# Altium project RF-UNIT-SPLIT.PrjPcb
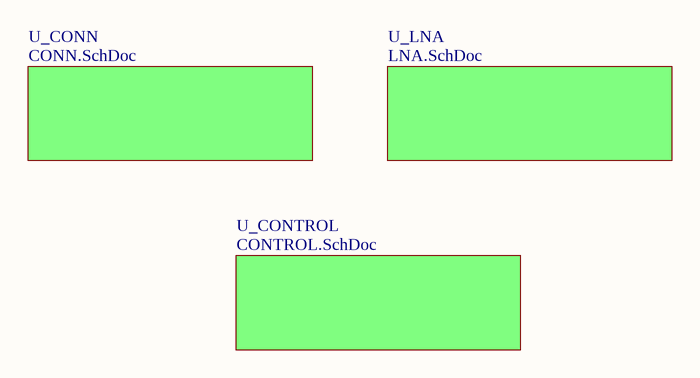
[diagram p0: RF-UNIT-SPLIT.SCHDOC]
4 sheets, 85 parts. Net scope: global (net labels, ports and power ports of the same name join across sheets).
Board file: RF-UNIT-SPLIT.PcbDoc
Sheets:
  RF-UNIT-SPLIT.SCHDOC
    U_CONN = CONN.SchDoc
    U_CONTROL = CONTROL.SchDoc
    U_LNA = LNA.SchDoc

## Sheet RF-UNIT-SPLIT.SCHDOC: RF-UNIT BIG
size A4; DocumentNumber: 12; Revision: 2.0; SheetNumber: 12; SheetTotal: 18

### Sub-sheets
U_CONN = CONN.SchDoc: no entries
U_CONTROL = CONTROL.SchDoc: no entries
U_LNA = LNA.SchDoc: no entries

### Notes on the sheet
- Title
- Size:
- Date:
- A4
- Number:
- Time:
- Revision:
- Sheet
- of
- File:

## Sheet CONN.SchDoc: CONNECTIONS
size A4; DocumentNumber: 14; Revision: 2.0; SheetNumber: 14; SheetTotal: 18
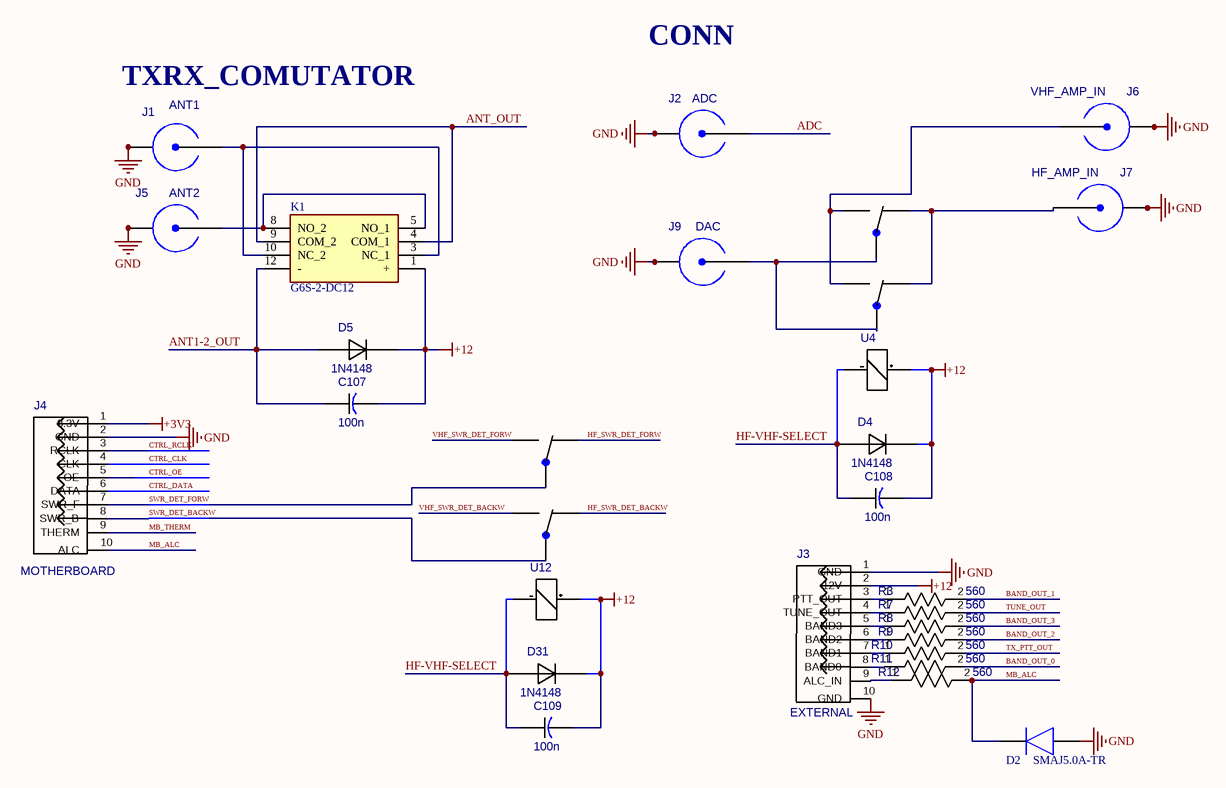
[diagram p1: CONN.SchDoc]

### Parts
C107  100n  [CAP_0805]
C108  100n  [CAP_0805]
C109  100n  [CAP_0805]
D2  SMAJ5.0A-TR  [SMBJ36CATR]
D4  1N4148  [SS14]
D5  1N4148  [SS14]
D31  1N4148  [SS14]
J1  ANT1  [31-5431]
J2  ADC  [31-5431]
J3  EXTERNAL  [90131-0126]
J4  MOTHERBOARD  [90131-0126]
J5  ANT2  [31-5431]
J6  VHF_AMP_IN  [31-5431]
J7  HF_AMP_IN  [31-5431]
J9  DAC  [31-5431]
K1  G6S-2-DC12  [G6S2DC12]
R3  560  [RES_0805]
R7  560  [RES_0805]
R8  560  [RES_0805]
R9  560  [RES_0805]
R10  560  [RES_0805]
R11  560  [RES_0805]
R12  560  [RES_0805]
U4  Axicom IM06  [IM06GR]  (value not drawn)
U12  Axicom IM06  [IM06GR]  (value not drawn)

### Nets
+3V3: J4.1(3.3V)
+12: C107.2 C108.2 C109.2 D4.1(K) D5.1(K) D31.1(K) J3.2(12V) K1.1(+) U4.1(+) U12.1(+)
GND: D2.2(A) J1.1(GND) J1.2(GND) J1.3(GND) J1.4(GND) J2.1(GND) J2.2(GND) J2.3(GND) J2.4(GND) J3.1(GND) J3.10(GND) J4.2(GND) J5.1(GND) J5.2(GND) J5.3(GND) J5.4(GND) J6.1(GND) J6.2(GND) J6.3(GND) J6.4(GND) J7.1(GND) J7.2(GND) J7.3(GND) J7.4(GND) J9.1(GND) J9.2(GND) J9.3(GND) J9.4(GND)
ADC: J2.5(CON)
ANT1-2_OUT: C107.1 D5.2(A) K1.12(-)
ANT_OUT: K1.4(COM_1) K1.9(COM_2)
BAND_OUT_0: R11.2
BAND_OUT_1: R3.2
BAND_OUT_2: R9.2
BAND_OUT_3: R8.2
CTRL_CLK: J4.4(CLK)
CTRL_DATA: J4.6(DATA)
CTRL_OE: J4.5(OE)
CTRL_RCLK: J4.3(RCLK)
HF-VHF-SELECT: C108.1 C109.1 D4.2(A) D31.2(A) U4.8(-) U12.8(-)
HF_SWR_DET_BACKW: U12.2(O)
HF_SWR_DET_FORW: U12.7(O)
MB_ALC: D2.1(K) J4.10(ALC) R12.2
MB_THERM: J4.9(THERM)
SWR_DET_BACKW: J4.8(SWR_B) U12.3(P)
SWR_DET_FORW: J4.7(SWR_F) U12.6(P)
TUNE_OUT: R7.2
TX_PTT_OUT: R10.2
VHF_SWR_DET_BACKW: U12.4(S)
VHF_SWR_DET_FORW: U12.5(S)
NetJ1_5: J1.5(CON) K1.3(NC_1) K1.10(NC_2)
NetJ3_3: J3.3(PTT_OUT) R3.1
NetJ3_4: J3.4(TUNE_OUT) R7.1
NetJ3_5: J3.5(BAND3) R8.1
NetJ3_6: J3.6(BAND2) R9.1
NetJ3_7: J3.7(BAND1) R10.1
NetJ3_8: J3.8(BAND0) R11.1
NetJ3_9: J3.9(ALC_IN) R12.1
NetJ5_5: J5.5(CON) K1.5(NO_1) K1.8(NO_2)
NetJ6_5: J6.5(CON) U4.4(S) U4.5(S)
NetJ7_5: J7.5(CON) U4.2(O) U4.7(O)
NetJ9_5: J9.5(CON) U4.3(P) U4.6(P)

### Notes on the sheet
- CONN
- TXRX_COMUTATOR
- Title
- Size:
- Date:
- A4
- Number:
- Time:
- Revision:
- Sheet
- of
- File:

### Library data of the parts
C107-C109 = CAP_0805
D2 = SMLVT3V3: Diode; Manufacturer_Name: STMicroelectronics; Allied_Number: 70013736; Datasheet Link: http://www.st.com/web/en/resource/technical/document/datasheet/CD00000923.pdf; Height: 2.65mm; Manufacturer_Part_Number: SMLVT3V3; Mouser Part Number: 511-SMLVT3V3; Mouser Price/Stock: https://www.mouser.com/Search/Refine.aspx?Keyword=511-SMLVT3V3; RS Part Number: 5444821P; RS Price/Stock: http://uk.rs-online.com/web/p/products/5444821P; Allied Price/Stock: http://www.alliedelec.com/stmicroelectronics-smlvt3v3/70013736/
J1 J2 J5-J7 J9 = 31-5431: SMA
  J2: Value: ADC
  J9: Value: DAC
J3 J4 = 90131-0126: 2*5 PIN; Value: *
K1 = G6S-2-DC12: Relay or Contactor; Manufacturer_Name: Omron Electronics; Datasheet Link: https://componentsearchengine.com/Datasheets/1/G6S-2-DC12.pdf; Height: 9.4mm; Manufacturer_Part_Number: G6S-2-DC12; Mouser Part Number: 653-G6S-2-DC12A; Mouser Price/Stock: https://www.mouser.co.uk/ProductDetail/Omron-Electronics/G6S-2-DC12/?qs=QGk6feVlqMLN9Ouv0QsFzA%3D%3D
R3 R7-R12 = RES_0805: Value: 560
D4 D5 D31 = 1N4148: Value: *
U4 U12 = Axicom IM06: Value: *

## Sheet CONTROL.SchDoc: CONTROLS
size 292 x 254 mm; DocumentNumber: 15; Revision: 2.0; SheetNumber: 15; SheetTotal: 18
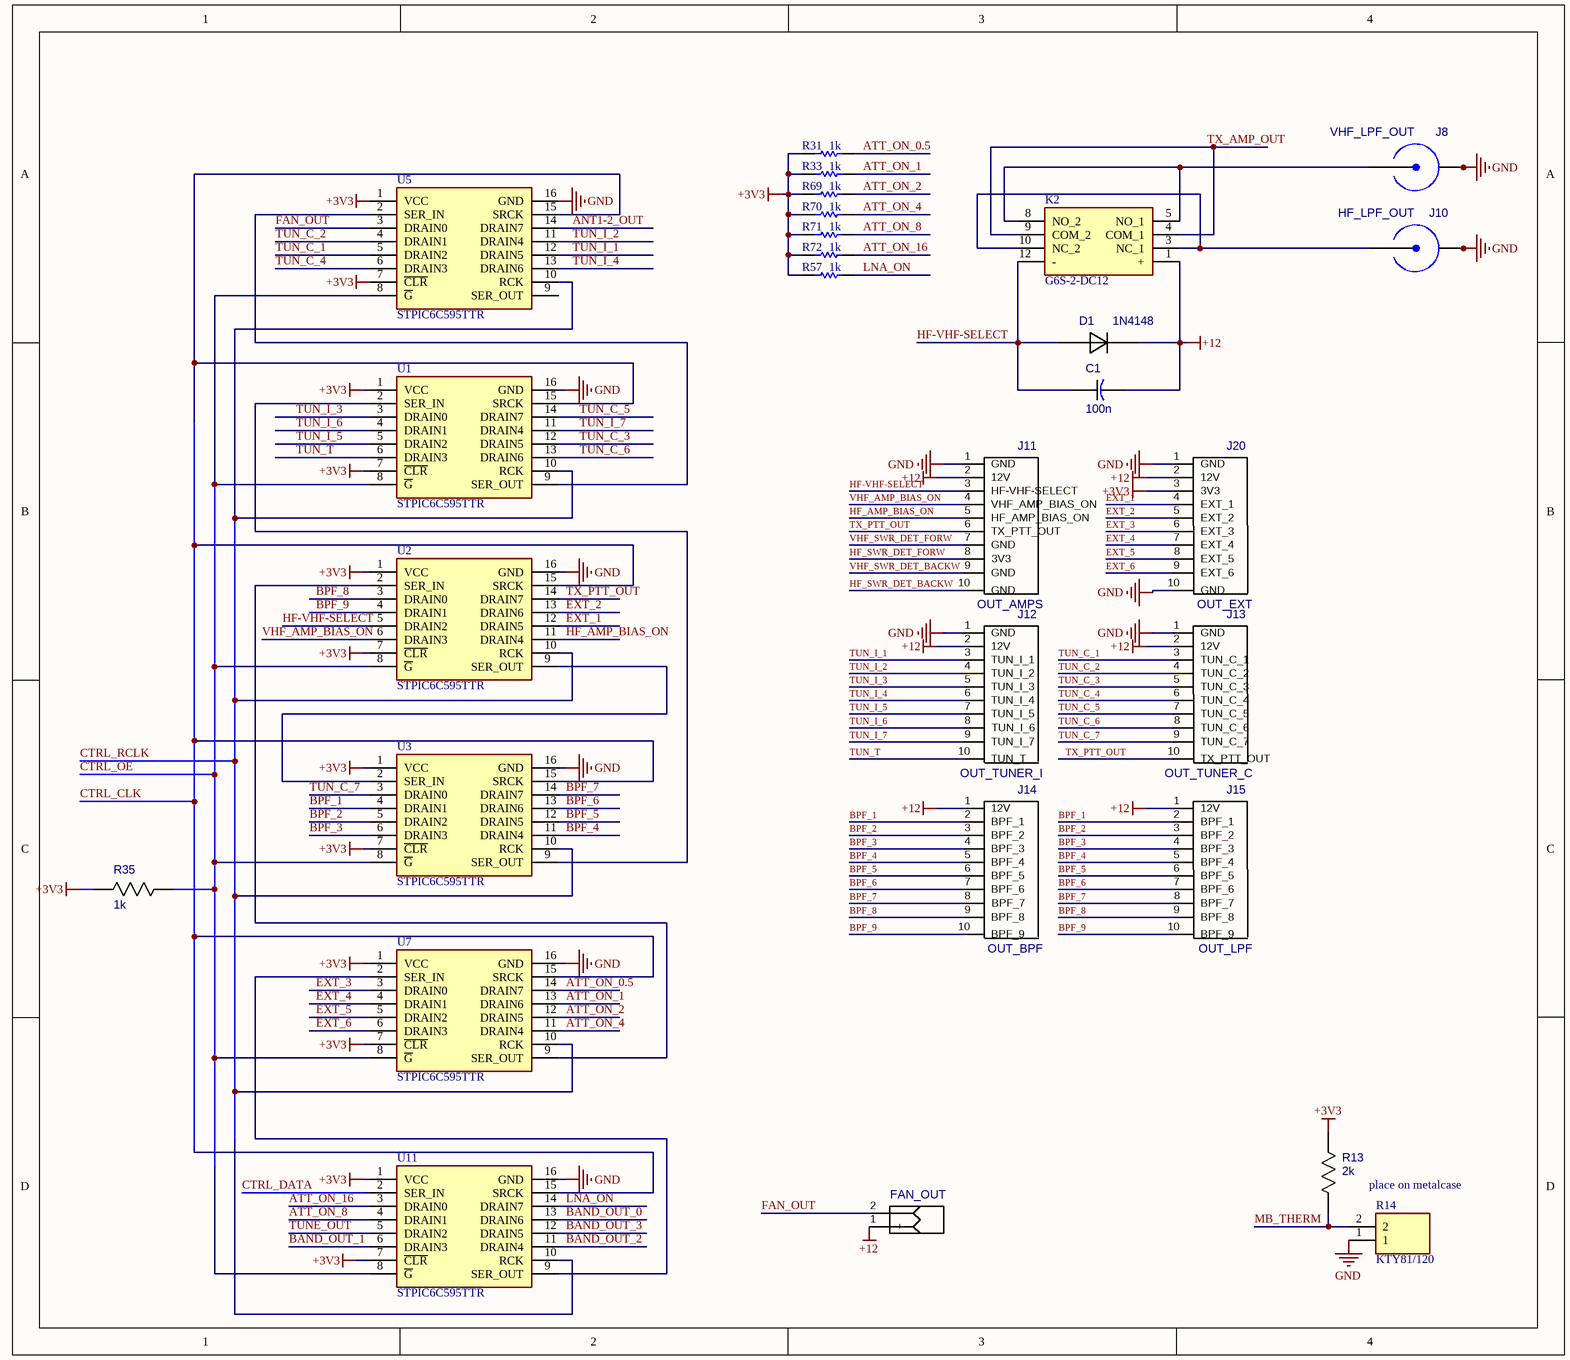
[diagram p2: CONTROL.SchDoc]

### Parts
C1  100n  [CAP_0805]
D1  1N4148  [SS14]
FAN_OUT  51022-0200  [51022-0200]  (value not drawn)
J8  VHF_LPF_OUT  [31-5431]
J10  HF_LPF_OUT  [31-5431]
J11  OUT_AMPS  [90131-0126]
J12  OUT_TUNER_I  [90131-0126]
J13  OUT_TUNER_C  [90131-0126]
J14  OUT_BPF  [90131-0126]
J15  OUT_LPF  [90131-0126]
J20  OUT_EXT  [90131-0126]
K2  G6S-2-DC12  [G6S2DC12]
R13  2k  [RES_0805]
R14  KTY81/120  [TO254P420X460X770-2P]
R31  1k  [RESC2013X60X40NL20T25]
R33  1k  [RESC2013X60X40NL20T25]
R35  1k  [RES_0805]
R57  1k  [RESC2013X60X40NL20T25]
R69  1k  [RESC2013X60X40NL20T25]
R70  1k  [RESC2013X60X40NL20T25]
R71  1k  [RESC2013X60X40NL20T25]
R72  1k  [RESC2013X60X40NL20T25]
U1  STPIC6C595TTR  [SOP65P640X120-16N]
U2  STPIC6C595TTR  [SOP65P640X120-16N]
U3  STPIC6C595TTR  [SOP65P640X120-16N]
U5  STPIC6C595TTR  [SOP65P640X120-16N]
U7  STPIC6C595TTR  [SOP65P640X120-16N]
U11  STPIC6C595TTR  [SOP65P640X120-16N]

### Nets
+3V3: J20.3(3V3) R13.2 R31.2 R33.2 R35.1 R57.2 R69.2 R70.2 R71.2 R72.2 U1.1(VCC) U1.7(~{CLR}) U2.1(VCC) U2.7(~{CLR}) U3.1(VCC) U3.7(~{CLR}) U5.1(VCC) U5.7(~{CLR}) U7.1(VCC) U7.7(~{CLR}) U11.1(VCC) U11.7(~{CLR})
+12: C1.2 D1.1(K) FAN_OUT.1(+) J11.2(12V) J12.2(12V) J13.2(12V) J14.1(12V) J15.1(12V) J20.2(12V) K2.1(+)
GND: J8.1(GND) J8.2(GND) J8.3(GND) J8.4(GND) J10.1(GND) J10.2(GND) J10.3(GND) J10.4(GND) J11.1(GND) J12.1(GND) J13.1(GND) J20.1(GND) J20.10(GND) R14.1 U1.16(GND) U2.16(GND) U3.16(GND) U5.16(GND) U7.16(GND) U11.16(GND)
ANT1-2_OUT: U5.14(DRAIN7)
ATT_ON_0.5: R31.1 U7.14(DRAIN7)
ATT_ON_1: R33.1 U7.13(DRAIN6)
ATT_ON_2: R69.1 U7.12(DRAIN5)
ATT_ON_4: R70.1 U7.11(DRAIN4)
ATT_ON_8: R71.1 U11.4(DRAIN1)
ATT_ON_16: R72.1 U11.3(DRAIN0)
BAND_OUT_0: U11.13(DRAIN6)
BAND_OUT_1: U11.6(DRAIN3)
BAND_OUT_2: U11.11(DRAIN4)
BAND_OUT_3: U11.12(DRAIN5)
BPF_1: J14.2(BPF_1) J15.2(BPF_1) U3.4(DRAIN1)
BPF_2: J14.3(BPF_2) J15.3(BPF_2) U3.5(DRAIN2)
BPF_3: J14.4(BPF_3) J15.4(BPF_3) U3.6(DRAIN3)
BPF_4: J14.5(BPF_4) J15.5(BPF_4) U3.11(DRAIN4)
BPF_5: J14.6(BPF_5) J15.6(BPF_5) U3.12(DRAIN5)
BPF_6: J14.7(BPF_6) J15.7(BPF_6) U3.13(DRAIN6)
BPF_7: J14.8(BPF_7) J15.8(BPF_7) U3.14(DRAIN7)
BPF_8: J14.9(BPF_8) J15.9(BPF_8) U2.3(DRAIN0)
BPF_9: J14.10(BPF_9) J15.10(BPF_9) U2.4(DRAIN1)
CTRL_CLK: U1.15(SRCK) U2.15(SRCK) U3.15(SRCK) U5.15(SRCK) U7.15(SRCK) U11.15(SRCK)
CTRL_DATA: U11.2(SER_IN)
CTRL_OE: R35.2 U1.8(~{G}) U2.8(~{G}) U3.8(~{G}) U5.8(~{G}) U7.8(~{G}) U11.8(~{G})
CTRL_RCLK: U1.10(RCK) U2.10(RCK) U3.10(RCK) U5.10(RCK) U7.10(RCK) U11.10(RCK)
EXT_1: J20.4(EXT_1) U2.12(DRAIN5)
EXT_2: J20.5(EXT_2) U2.13(DRAIN6)
EXT_3: J20.6(EXT_3) U7.3(DRAIN0)
EXT_4: J20.7(EXT_4) U7.4(DRAIN1)
EXT_5: J20.8(EXT_5) U7.5(DRAIN2)
EXT_6: J20.9(EXT_6) U7.6(DRAIN3)
FAN_OUT: FAN_OUT.2(-) U5.3(DRAIN0)
HF-VHF-SELECT: C1.1 D1.2(A) J11.3(HF-VHF-SELECT) K2.12(-) U2.5(DRAIN2)
HF_AMP_BIAS_ON: J11.5(HF_AMP_BIAS_ON) U2.11(DRAIN4)
HF_SWR_DET_BACKW: J11.10(GND)
HF_SWR_DET_FORW: J11.8(3V3)
LNA_ON: R57.1 U11.14(DRAIN7)
MB_THERM: R13.1 R14.2
TUN_I_1: J12.3(TUN_I_1) U5.12(DRAIN5)
TUN_I_2: J12.4(TUN_I_2) U5.11(DRAIN4)
TUN_I_3: J12.5(TUN_I_3) U1.3(DRAIN0)
TUN_I_4: J12.6(TUN_I_4) U5.13(DRAIN6)
TUN_I_5: J12.7(TUN_I_5) U1.5(DRAIN2)
TUN_I_6: J12.8(TUN_I_6) U1.4(DRAIN1)
TUN_I_7: J12.9(TUN_I_7) U1.11(DRAIN4)
TUN_T: J12.10(TUN_T) U1.6(DRAIN3)
TUN_С_1: J13.3(TUN_C_1) U5.5(DRAIN2)
TUN_С_2: J13.4(TUN_C_2) U5.4(DRAIN1)
TUN_С_3: J13.5(TUN_C_3) U1.12(DRAIN5)
TUN_С_4: J13.6(TUN_C_4) U5.6(DRAIN3)
TUN_С_5: J13.7(TUN_C_5) U1.14(DRAIN7)
TUN_С_6: J13.8(TUN_C_6) U1.13(DRAIN6)
TUN_С_7: J13.9(TUN_C_7) U3.3(DRAIN0)
TUNE_OUT: U11.5(DRAIN2)
TX_AMP_OUT: K2.4(COM_1) K2.9(COM_2)
TX_PTT_OUT: J11.6(TX_PTT_OUT) J13.10(TX_PTT_OUT) U2.14(DRAIN7)
VHF_AMP_BIAS_ON: J11.4(VHF_AMP_BIAS_ON) U2.6(DRAIN3)
VHF_SWR_DET_BACKW: J11.9(GND)
VHF_SWR_DET_FORW: J11.7(GND)
NetJ8_5: J8.5(CON) K2.5(NO_1) K2.8(NO_2)
NetJ10_5: J10.5(CON) K2.3(NC_1) K2.10(NC_2)
NetU1_2: U1.2(SER_IN) U3.9(SER_OUT)
NetU1_9: U1.9(SER_OUT) U5.2(SER_IN)
NetU2_2: U2.2(SER_IN) U7.9(SER_OUT)
NetU2_9: U2.9(SER_OUT) U3.2(SER_IN)
NetU7_2: U7.2(SER_IN) U11.9(SER_OUT)

Not connected (* = marked no-connect by the designer): U5 9(SER_OUT)

### Notes on the sheet
- place on metalcase
- Title
- Size:
- Date:
- A4
- Number:
- Time:
- Revision:
- Sheet
- of
- File:

### Library data of the parts
C1 = CAP_0805
J8 J10 = 31-5431: SMA
J11-J15 J20 = 90131-0126_1_1: 2*5 PIN; Value: *
K2 = G6S-2-DC12: as K1 on sheet CONN; Datasheet Link: https://componentsearchengine.com/Datasheets/1/G6S-2-DC12.pdf; Height: 9.4mm; Manufacturer_Part_Number: G6S-2-DC12; Mouser Part Number: 653-G6S-2-DC12A; Mouser Price/Stock: https://www.mouser.co.uk/ProductDetail/Omron-Electronics/G6S-2-DC12/?qs=QGk6feVlqMLN9Ouv0QsFzA%3D%3D
R13 R35 = RES_0805
  R35: Value: 1k
R14 = KTY81_110: Integrated Circuit; Manufacturer_Name: Nexperia; Manufacturer_Part_Number: KTY81/110; Datasheet Link: https://www.nxp.com/docs/en/data-sheet/KTY81_SER.pdf; Height: 4.2mm
R31 R33 R57 R69-R72 = CMP-2001-00626-1: RES_0805; Manufacturer: Panasonic; Part Number: ERA-6AEB303V
U1-U3 U5 U7 U11 = STPIC6C595TTR: Integrated Circuit; Manufacturer_Name: STMicroelectronics; Datasheet Link: http://www.st.com/st-web-ui/static/active/en/resource/technical/document/datasheet/CD00020664.pdf; Height: 1.2mm; Manufacturer_Part_Number: STPIC6C595TTR; Mouser Part Number: 511-STPIC6C595T; Mouser Price/Stock: https://www.mouser.co.uk/ProductDetail/STMicroelectronics/STPIC6C595TTR?qs=Pgvhs884FskRYYZkj3y%2FSg%3D%3D; Arrow Part Number: STPIC6C595TTR; Arrow Price/Stock: https://www.arrow.com/en/products/stpic6c595ttr/stmicroelectronics
D1 = 1N4148: Value: *

## Sheet LNA.SchDoc: LNA+ATT
size A4; DocumentNumber: 16; Revision: 2.0; SheetNumber: 16; SheetTotal: 18
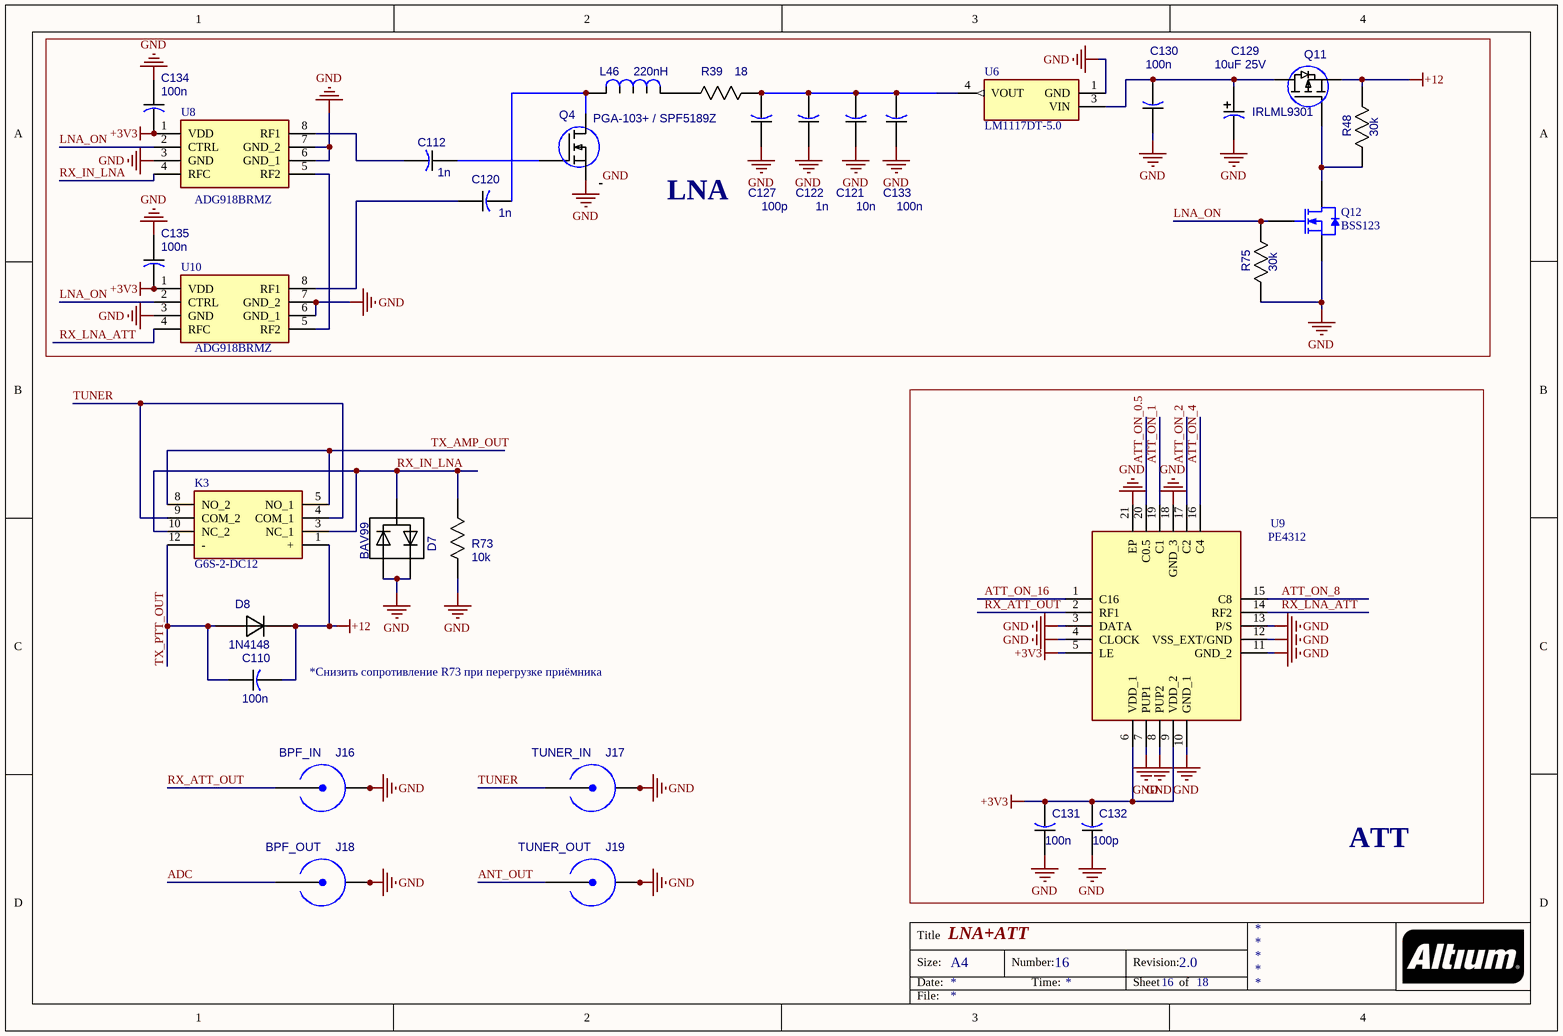
[diagram p3: LNA.SchDoc]

### Parts
C110  100n  [CAP_0805]
C112  1n  [CAP_0805]
C120  1n  [CAP_0805]
C121  10n  [6-0805_M]
C122  1n  [6-0805_M]
C127  100p  [6-0805_M]
C129  10uF 25V  [CAPAE_5.3x5.3h6.1]
C130  100n  [CAP_0805]
C131  100n  [6-0805_M]
C132  100p  [6-0805_M]
C133  100n  [CAP_0805]
C134  100n  [CAP_0805]
C135  100n  [CAP_0805]
D7  BAV99  [SOT23]
D8  1N4148  [SS14]
J16  BPF_IN  [31-5431]
J17  TUNER_IN  [31-5431]
J18  BPF_OUT  [31-5431]
J19  TUNER_OUT  [31-5431]
K3  G6S-2-DC12  [G6S2DC12]
L46  220nH  [IND_1206]
Q4  PGA-103+ / SPF5189Z  [SOT89]
Q11  IRLML9301  [SOT23]
Q12  BSS123  [FAIR-SOT23-3_V]
R39  18  [RES_1206]
R48  30k  [RES_0805]
R73  10k  [RES_1206]
R75  30k  [RES_0805]
U6  LM1117DT-5.0  [TO228P991X238-3N]
U8  ADG918BRMZ  [SOP65P490X110-8N]
U9  PE4312  [QFN50P400X400X90-21N]
U10  ADG918BRMZ  [SOP65P490X110-8N]

### Blocks framed on the sheet
LNA: C112 C120-C122 C127 C129 C130 C133-C135 L46 Q4 Q11 Q12 R39 R48 R75 U6 U8 U10
ATT: C131 C132 U9

### Nets
+3V3: C131.2 C132.2 C134.2 C135.2 U8.1(VDD) U9.5(LE) U9.6(VDD_1) U9.9(VDD_2) U10.1(VDD)
+12: C110.2 D8.1(K) K3.1(+) Q11.2(S) R48.2
GND: C121.1 C122.1 C127.1 C129.2(MINUS) C130.1 C131.1 C132.1 C133.1 C134.1 C135.1 D7.1(A(D1)) D7.2(C(D2)) J16.1(GND) J16.2(GND) J16.3(GND) J16.4(GND) J17.1(GND) J17.2(GND) J17.3(GND) J17.4(GND) J18.1(GND) J18.2(GND) J18.3(GND) J18.4(GND) J19.1(GND) J19.2(GND) J19.3(GND) J19.4(GND) Q4.0 Q4.2(S) Q12.2(S) R73.1 R75.1 U6.1(GND) U8.3(GND) U8.6(GND_1) U8.7(GND_2) U9.3(DATA) U9.4(CLOCK) U9.7(PUP1) U9.8(PUP2) U9.10(GND_1) U9.11(GND_2) U9.12(VSS_EXT/GND) U9.13(P/S) U9.18(GND_3) U9.21(EP) U10.3(GND) U10.6(GND_1) U10.7(GND_2)
ADC: J18.5(CON)
ANT_OUT: J19.5(CON)
ATT_ON_0.5: U9.20(C0.5)
ATT_ON_1: U9.19(C1)
ATT_ON_2: U9.17(C2)
ATT_ON_4: U9.16(C4)
ATT_ON_8: U9.15(C8)
ATT_ON_16: U9.1(C16)
LNA_ON: Q12.1(G) R75.2 U8.2(CTRL) U10.2(CTRL)
RX_ATT_OUT: J16.5(CON) U9.2(RF1)
RX_IN_LNA: D7.3(C(D1),A(D2)) K3.3(NC_1) K3.10(NC_2) R73.2 U8.4(RFC)
RX_LNA_ATT: U9.14(RF2) U10.4(RFC)
TUNER: J17.5(CON) K3.4(COM_1) K3.9(COM_2)
TX_AMP_OUT: K3.5(NO_1) K3.8(NO_2)
TX_PTT_OUT: C110.1 D8.2(A) K3.12(-)
NetC112_1: C112.1 Q4.1(G)
NetC112_2: C112.2 U8.8(RF1)
NetC120_1: C120.1 U10.8(RF1)
NetC120_2: C120.2 L46.2 Q4.3(D)
NetC121_2: C121.2 C122.2 C127.2 C133.2 R39.1 U6.4(VOUT)
NetC129_1: C129.1(PLUS) C130.2 Q11.3(D) U6.3(VIN)
NetL46_1: L46.1 R39.2
NetQ11_1: Q11.1(G) Q12.3(D) R48.1
NetU8_5: U8.5(RF2) U10.5(RF2)

### Notes on the sheet
- *Снизить сопротивление R73 при перегрузке приёмника
- Title
- Size:
- Date:
- A4
- Number:
- Time:
- Revision:
- Sheet
- of
- File:

### Library data of the parts
C110 C112 C120-C122 C127 C130-C135 = CAP_0805
  C121: Value: 10n
  C122: Value: 1n
  C127 C132: Value: 100p
  C130 C131 C133-C135: Value: 100n
C129 = CAPAE_5.3x5.3h6.1: Value: 10uF 25V
J16-J19 = 31-5431: SMA
K3 = G6S-2-DC12: as K1 on sheet CONN; Datasheet Link: https://componentsearchengine.com/Datasheets/1/G6S-2-DC12.pdf; Height: 9.4mm; Manufacturer_Part_Number: G6S-2-DC12; Mouser Part Number: 653-G6S-2-DC12A; Mouser Price/Stock: https://www.mouser.co.uk/ProductDetail/Omron-Electronics/G6S-2-DC12/?qs=QGk6feVlqMLN9Ouv0QsFzA%3D%3D
L46 = IND_1206: Value: 220nH
Q4 = PGA-103+
Q11 = MOSFET_ENH_PD: MOSFET; Value: IRLML9301
Q12 = CMP-2000-04934-1: N-Channel Logic Level Enhancement Mode Field Effect Transistor, 1.7 V, -55 to 150 degC, 3-Pin SOT-23, RoHS, Tape and Reel; Manufacturer: Fairchild; Channel Type: N; Typical Turn-Off Delay Time: 17ns; Maximum Continuous Drain Current: 0.17A; Rad Hard: No; Typical Rise Time: 9ns; Typical Fall Time: 2.4ns; Maximum Gate Source Voltage: ±20V; Maximum Drain Source Voltage: 100V; Typical Turn-On Delay Time: 1.7ns; RDS-on: 6000@10VmOhm; Package Version: Rev. 12, 03/2016; Packaging: Tape&Reel; Package Reference: SOT23-3; Channel Mode: Enhancement; Operating Temperature: -55to150degC; Package Description: 3-Pin Small Outline Transistor, Body 2.92 x 1.325 mm, Pitch 0.95 mm; Category: MOSFET; Datasheet Version: Jun-03; Datasheet URL: https://www.fairchildsemi.com/datasheets/BS/BSS123.pdf; Manufacturer URL: https://www.fairchildsemi.com/; Mounting: SurfaceMount; Package: 3SOT-23; Package URL: http://www.fairchildsemi.com/dwg/MA/MA03D.pdf
R39 R73 = RES_1206
  R39: Value: 18
R48 R75 = RES_0805: Value: 30k
U6 = LM1117DT-ADJ: Integrated Circuit; Manufacturer_Name: Texas Instruments; Datasheet Link: http://www.ti.com/lit/ds/symlink/lm1117-n.pdf; Height: 2.38mm; Manufacturer_Part_Number: LM1117DT-ADJ; Mouser Part Number: 926-LM1117DT-ADJ; Mouser Price/Stock: https://www.mouser.com/Search/Refine.aspx?Keyword=926-LM1117DT-ADJ
U8 U10 = ADG918BRMZ: Integrated Circuit; Manufacturer_Name: Analog Devices; Datasheet Link: http://www.analog.com/static/imported-files/data_sheets/ADG918_919.pdf; Height: 1.1mm; Manufacturer_Part_Number: ADG918BRMZ; Mouser Part Number: 584-ADG918BRMZ; Mouser Price/Stock: https://www.mouser.co.uk/ProductDetail/Analog-Devices/ADG918BRMZ?qs=BpaRKvA4VqHrp1TCwMhfnw%3D%3D; RS Part Number: 4969212P; RS Price/Stock: http://uk.rs-online.com/web/p/products/4969212P
U9 = PE4312C-Z: Integrated Circuit; Manufacturer_Name: pSemi; Datasheet Link: https://www.psemi.com/pdf/datasheets/pe4312ds.pdf; Height: 0.9mm; Manufacturer_Part_Number: PE4312C-Z; Mouser Part Number: N/A; Mouser Price/Stock: https://www.mouser.com/Search/Refine.aspx?Keyword=N%2FA
D7 = BAV99: Value: BAV99
D8 = 1N4148: Value: *

## Nets that join several sheets
+3V3: CONN (J4.1), CONTROL (22 pins), LNA (9 pins)
+12: CONN (10 pins), CONTROL (10 pins), LNA (5 pins)
GND: CONN (28 pins), CONTROL (20 pins), LNA (50 pins)
ADC: CONN (J2.5), LNA (J18.5)
ANT1-2_OUT: CONN (C107.1 D5.2 K1.12), CONTROL (U5.14)
ANT_OUT: CONN (K1.4 K1.9), LNA (J19.5)
ATT_ON_0.5: CONTROL (R31.1 U7.14), LNA (U9.20)
ATT_ON_1: CONTROL (R33.1 U7.13), LNA (U9.19)
ATT_ON_2: CONTROL (R69.1 U7.12), LNA (U9.17)
ATT_ON_4: CONTROL (R70.1 U7.11), LNA (U9.16)
ATT_ON_8: CONTROL (R71.1 U11.4), LNA (U9.15)
ATT_ON_16: CONTROL (R72.1 U11.3), LNA (U9.1)
BAND_OUT_0: CONN (R11.2), CONTROL (U11.13)
BAND_OUT_1: CONN (R3.2), CONTROL (U11.6)
BAND_OUT_2: CONN (R9.2), CONTROL (U11.11)
BAND_OUT_3: CONN (R8.2), CONTROL (U11.12)
CTRL_CLK: CONN (J4.4), CONTROL (6 pins)
CTRL_DATA: CONN (J4.6), CONTROL (U11.2)
CTRL_OE: CONN (J4.5), CONTROL (7 pins)
CTRL_RCLK: CONN (J4.3), CONTROL (6 pins)
HF-VHF-SELECT: CONN (6 pins), CONTROL (5 pins)
HF_SWR_DET_BACKW: CONN (U12.2), CONTROL (J11.10)
HF_SWR_DET_FORW: CONN (U12.7), CONTROL (J11.8)
LNA_ON: CONTROL (R57.1 U11.14), LNA (Q12.1 R75.2 U8.2 U10.2)
MB_THERM: CONN (J4.9), CONTROL (R13.1 R14.2)
TUNE_OUT: CONN (R7.2), CONTROL (U11.5)
TX_AMP_OUT: CONTROL (K2.4 K2.9), LNA (K3.5 K3.8)
TX_PTT_OUT: CONN (R10.2), CONTROL (J11.6 J13.10 U2.14), LNA (C110.1 D8.2 K3.12)
VHF_SWR_DET_BACKW: CONN (U12.4), CONTROL (J11.9)
VHF_SWR_DET_FORW: CONN (U12.5), CONTROL (J11.7)